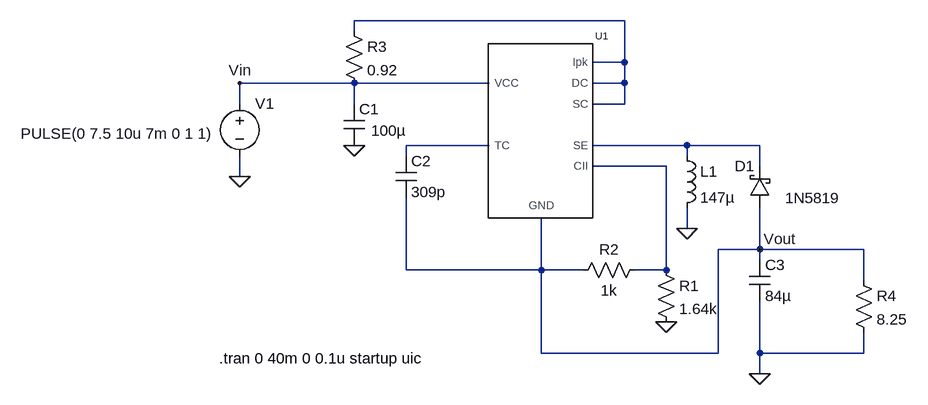
[diagram p0: schematic MC34063AD_testbench.asc]
MC34063AD_testbench.asc, the LTspice schematic file:
Version 4
SHEET 1 984 772
WIRE 304 176 -112 176
WIRE -112 192 -112 176
WIRE 304 240 304 176
WIRE 304 240 256 240
WIRE -112 272 -288 272
WIRE 96 272 -112 272
WIRE 304 272 304 240
WIRE 304 272 256 272
WIRE -288 304 -288 272
WIRE -112 304 -112 272
WIRE 304 304 304 272
WIRE 304 304 256 304
WIRE 96 368 -32 368
WIRE 400 368 256 368
WIRE 512 368 400 368
WIRE -32 384 -32 368
WIRE 400 384 400 368
WIRE 368 400 256 400
WIRE 512 400 512 368
WIRE -288 416 -288 384
WIRE 400 496 400 464
WIRE 512 528 512 464
WIRE 512 528 448 528
WIRE 672 528 512 528
WIRE 512 544 512 528
WIRE -32 560 -32 448
WIRE 176 560 176 480
WIRE 176 560 -32 560
WIRE 240 560 176 560
WIRE 368 560 368 400
WIRE 368 560 320 560
WIRE 672 576 672 528
WIRE 176 688 176 560
WIRE 448 688 448 528
WIRE 448 688 176 688
WIRE 512 688 512 608
WIRE 672 688 672 656
WIRE 672 688 512 688
WIRE 512 720 512 688
FLAG -288 416 0
FLAG 400 496 0
FLAG 368 640 0
FLAG -112 368 0
FLAG 512 528 Vout
FLAG -288 272 Vin
FLAG 512 720 0
SYMBOL cap -128 304 R0
WINDOW 3 42 41 Left 2
SYMATTR Value 100µ
SYMATTR InstName C1
SYMBOL cap -48 384 R0
SYMATTR InstName C2
SYMATTR Value 309p
SYMBOL cap 496 544 R0
SYMATTR InstName C3
SYMATTR Value 84µ
SYMATTR SpiceLine Rser=0
SYMBOL ind 384 368 R0
SYMATTR InstName L1
SYMATTR Value 147µ
SYMATTR SpiceLine Rser=0
SYMBOL schottky 528 464 R180
WINDOW 0 24 64 Left 2
WINDOW 3 -108 15 Left 2
SYMATTR InstName D1
SYMATTR Value 1N5819
SYMATTR Description Diode
SYMATTR Type diode
SYMBOL res 352 544 R0
SYMATTR InstName R1
SYMATTR Value 1.64k
SYMBOL res 336 544 R90
WINDOW 0 0 56 VBottom 2
WINDOW 3 32 56 VTop 2
SYMATTR InstName R2
SYMATTR Value 1k
SYMBOL res -128 176 R0
SYMATTR InstName R3
SYMATTR Value 0.92
SYMBOL mc33063a 208 304 R0
SYMATTR InstName U1
SYMBOL res 656 560 R0
SYMATTR InstName R4
SYMATTR Value 8.25
SYMBOL voltage -288 288 R0
WINDOW 3 -337 62 Left 2
WINDOW 123 0 0 Left 0
WINDOW 39 0 0 Left 0
SYMATTR InstName V1
SYMATTR Value PULSE(0 7.5 10u 7m 0 1 1)
TEXT -320 696 Left 2 !.tran 0 40m 0 0.1u startup uic

The netlist it stands for:
* MC34063AD_testbench.asc
C1 Vin 0 100µ
C2 N002 Vout 309p
C3 Vout 0 84µ Rser=0
L1 N003 0 147µ Rser=0
D1 Vout N003 1N5819
R1 N004 0 1.64k
R2 N004 Vout 1k
R3 N001 Vin 0.92
XU1 N001 N003 N002 Vout N004 Vin N001 N001 MC33063A  ; pins SC SE TC GND CII VCC Ipk DC
R4 Vout 0 8.25
V1 Vin 0 PULSE(0 7.5 10u 7m 0 1 1)
.model D D
.lib standard.dio
.tran 0 40m 0 0.1u startup uic
.lib MC33063A.LIB
.backanno
.end